# Altium schematic sheet control_connector.SchDoc
size A4; SheetNumber: 7; SheetTotal: 12; SPICEModelCacheRONAVTZR: <root> / <DocumentId>RONAVTZR</DocumentId> / </root>
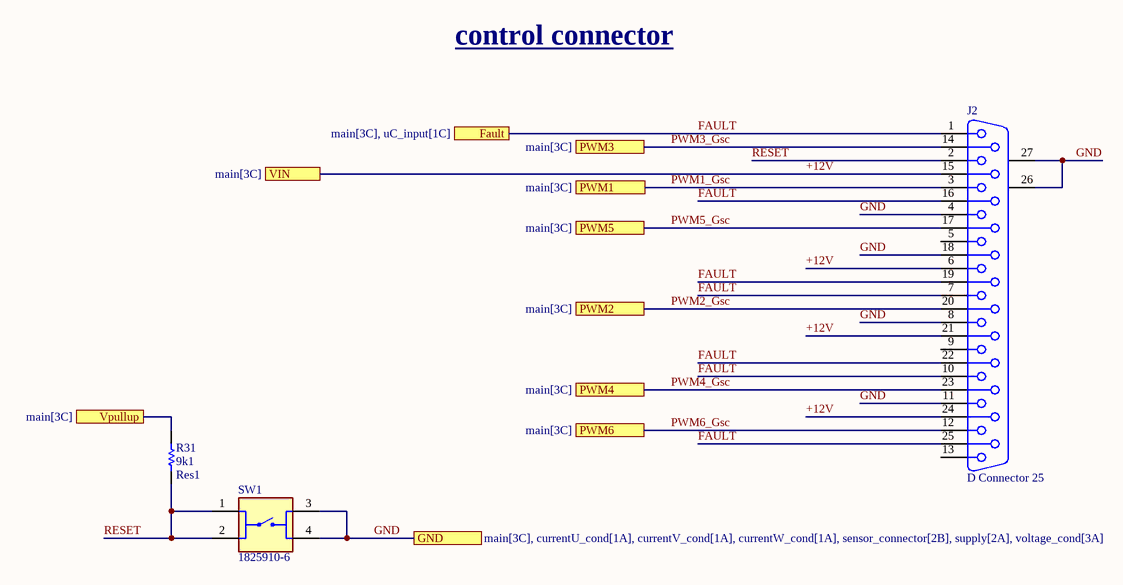
[diagram p0: control_connector.SchDoc]

## Parts
J2  D Connector 25  [DSUB1.385-2H25A_mod]
R31  Res1  value 9k1  [AXIAL-0.3_mod]
SW1  1825910-6  [SW_1825910-6-4_mod]

## Ports
Fault (see main[3C], uC_input[1C]), GND (see main[3C], currentU_cond[1A], currentV_cond[1A], currentW_cond[1A], sensor_connector[2B], supply[2A], voltage_cond[3A]), PWM1 (see main[3C]), PWM2 (see main[3C]), PWM3 (see main[3C]), PWM4 (see main[3C]), PWM5 (see main[3C]), PWM6 (see main[3C]), VIN (see main[3C]), Vpullup (see main[3C])

## Nets
+12V: J2.6 J2.15 J2.21 J2.24 ; port VIN
FAULT: J2.1 J2.7 J2.10 J2.16 J2.19 J2.22 J2.25 ; port Fault
GND: J2.4 J2.8 J2.11 J2.18 J2.26(MH1) J2.27(MH2) SW1.3 SW1.4 ; port GND
PWM1_Gsc: J2.3 ; port PWM1
PWM2_Gsc: J2.20 ; port PWM2
PWM3_Gsc: J2.14 ; port PWM3
PWM4_Gsc: J2.23 ; port PWM4
PWM5_Gsc: J2.17 ; port PWM5
PWM6_Gsc: J2.12 ; port PWM6
RESET: J2.2 R31.1 SW1.1 SW1.2
Vpullup: R31.2 ; port Vpullup

Not connected (* = marked no-connect by the designer): J2 5 9 13

## Notes on the sheet
- control connector

## Library data of the parts
J2 = D Connector 25: Receptacle Assembly, 25 Position, Right Angle; PackageDocument: U; Positions: 25; Published: 15-Jun-2001; LatestRevisionDate: 17-Jul-2002; LatestRevisionNote: Re-released for DXP Platform.; DatasheetDocument: 19-Mar-1999; PackageReference: 787202; Publisher: Altium Limited; Orientation: Right Angle; Gender: Receptacle
R31 = Res1: Resistor; Published: 8-Jun-2000; LatestRevisionDate: 17-Jul-2002; LatestRevisionNote: Re-released for DXP Platform.; PackageReference: AXIAL-0.3; Publisher: Altium Limited; PackageDescription: Axial Device, Thru-Hole; 2 Leads; 0.3 in Pin Spacing
SW1 = 1825910-6: Switch Push Button OFF (ON) SPST Round Button 0.05A 24VDC Momentary Contact PC Pins Thru-Hole; MF: TE Connectivity; Value: *; MP: 1825910-6; Package: None; Check_prices: https://www.snapeda.com/parts/1825910-6/TE+Connectivity+ALCOSWITCH+Switches/view-part/?ref=eda; SnapEDA_Link: https://www.snapeda.com/parts/1825910-6/TE+Connectivity+ALCOSWITCH+Switches/view-part/?ref=snap; Digi-Key_Part_Number: 450-1650-ND; Purchase-URL: https://pricing.snapeda.com/search/part/1825910-6/?ref=eda